# Altium schematic sheet filters.SchDoc
size 381 x 241 mm; SheetNumber: 5; SheetTotal: 11
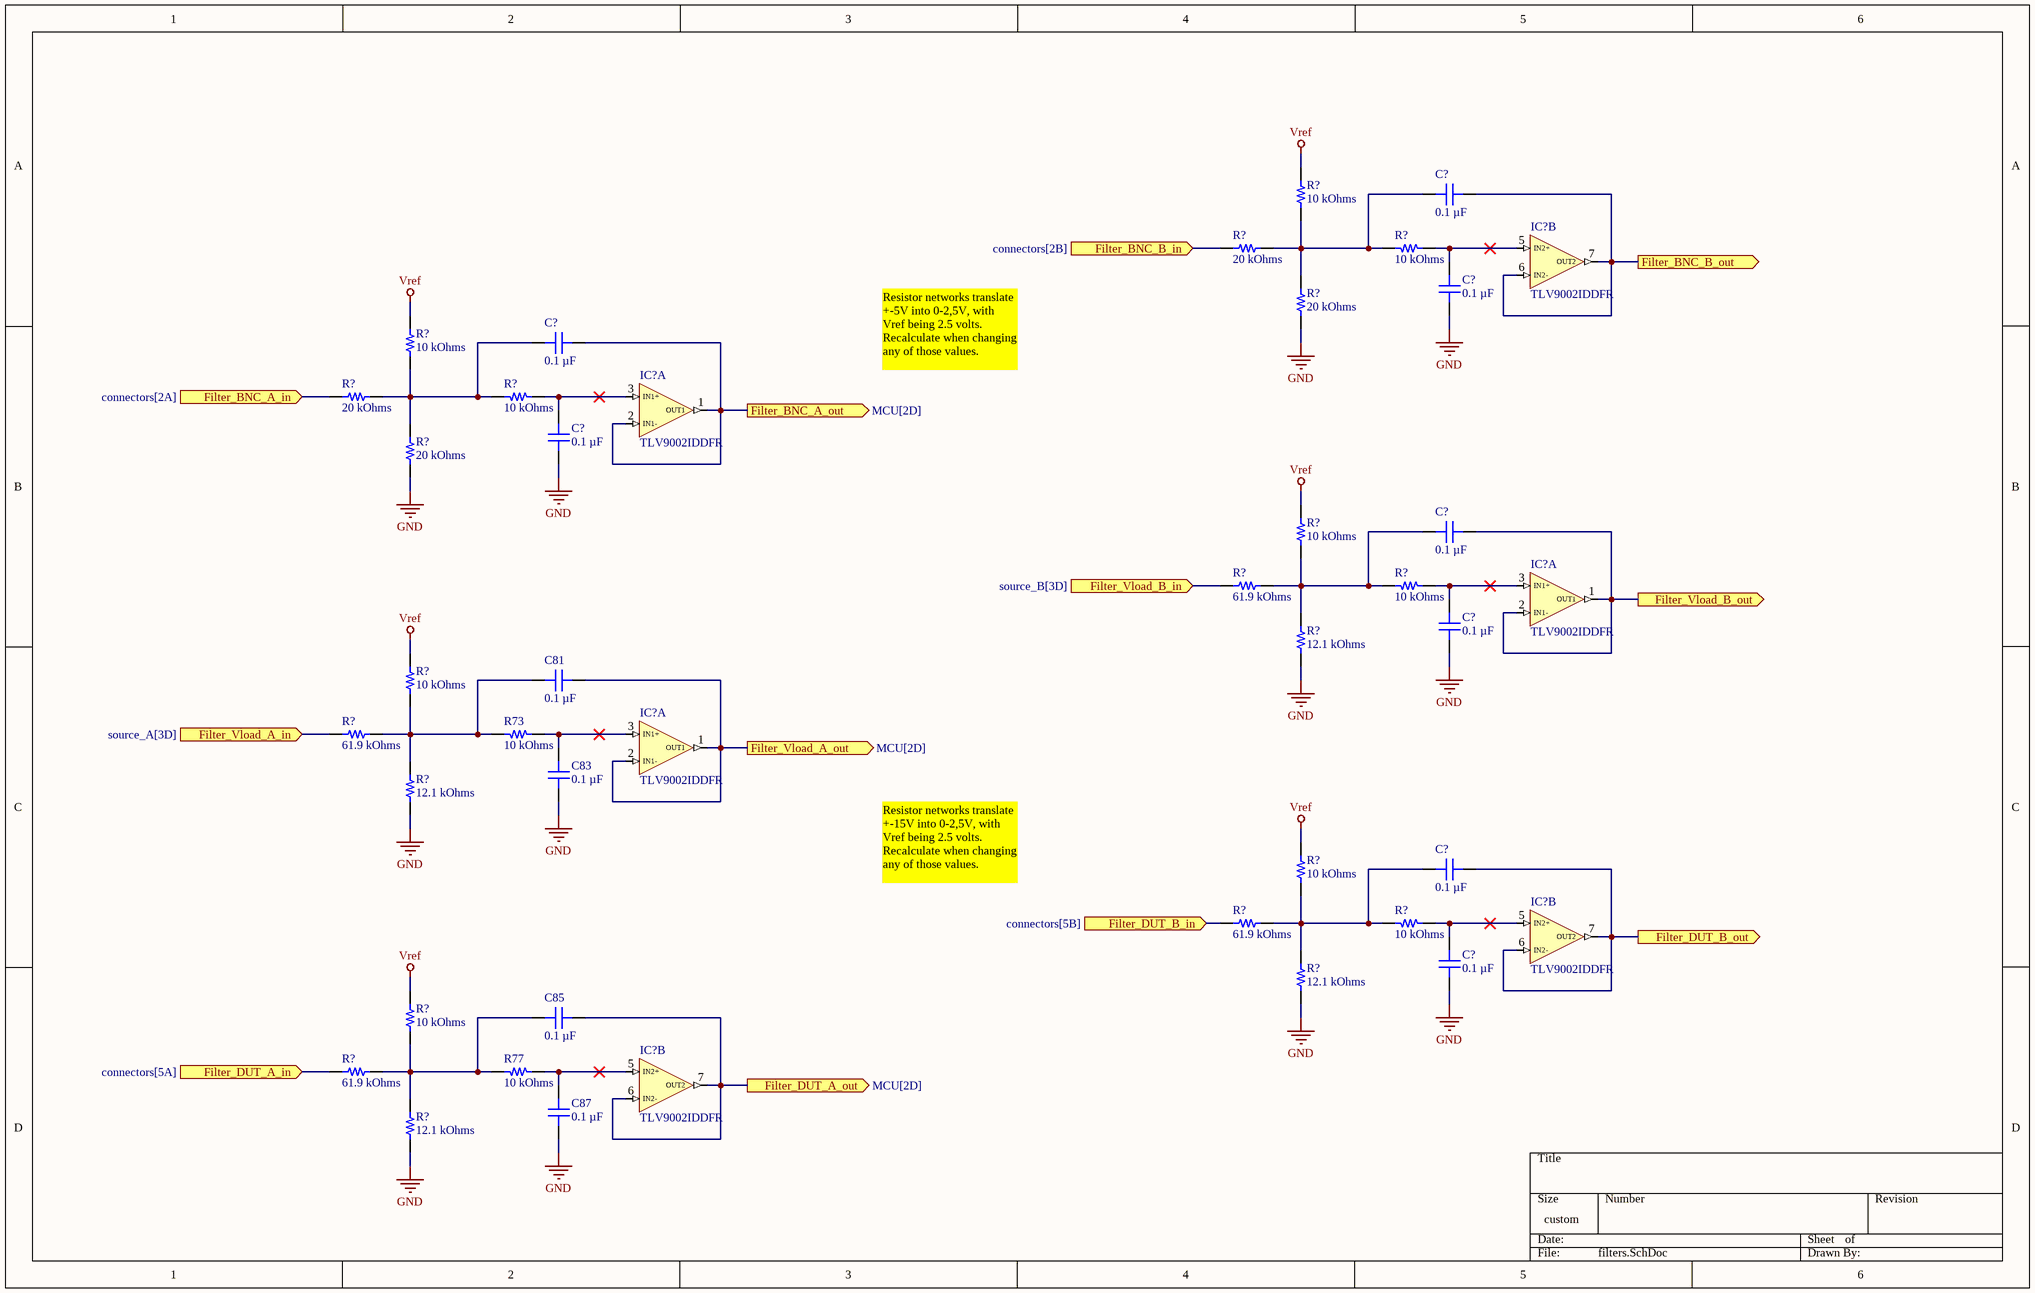
[diagram p0: filters.SchDoc]

## Parts
(Parts that share a designator on the sheet are numbered #1, #2 ... from top to bottom, then left to right.)
C81  0.1 µF  [CAP 1206_3216 - 0.8MM]
C83  0.1 µF  [CAP 1206_3216 - 0.8MM]
C85  0.1 µF  [CAP 1206_3216 - 0.8MM]
C87  0.1 µF  [CAP 1206_3216 - 0.8MM]
C?#1  0.1 µF  [CAP 1206_3216 - 0.8MM]
C?#2  0.1 µF  [CAP 1206_3216 - 0.8MM]
C?#3  0.1 µF  [CAP 1206_3216 - 0.8MM]
C?#4  0.1 µF  [CAP 1206_3216 - 0.8MM]
C?#5  0.1 µF  [CAP 1206_3216 - 0.8MM]
C?#6  0.1 µF  [CAP 1206_3216 - 0.8MM]
C?#7  0.1 µF  [CAP 1206_3216 - 0.8MM]
C?#8  0.1 µF  [CAP 1206_3216 - 0.8MM]
IC?#1  TLV9002IDDFR  [SOT65P280X110-8N]  (part B of 3)
IC?#2  TLV9002IDDFR  [SOT65P280X110-8N]  (part A of 3)
IC?#3  TLV9002IDDFR  [SOT65P280X110-8N]  (part A of 3)
IC?#4  TLV9002IDDFR  [SOT65P280X110-8N]  (part A of 3)
IC?#5  TLV9002IDDFR  [SOT65P280X110-8N]  (part B of 3)
IC?#6  TLV9002IDDFR  [SOT65P280X110-8N]  (part B of 3)
R73  10 kOhms  [YAGEO RES 1206_3216]
R77  10 kOhms  [YAGEO RES 1206_3216]
R?#1  10 kOhms  [RES 1206_3216]
R?#2  20 kOhms  [RES 1206_3216]
R?#3  10 kOhms  [YAGEO RES 1206_3216]
R?#4  20 kOhms  [RES 1206_3216]
R?#5  10 kOhms  [RES 1206_3216]
R?#6  20 kOhms  [RES 1206_3216]
R?#7  10 kOhms  [YAGEO RES 1206_3216]
R?#8  20 kOhms  [RES 1206_3216]
R?#9  10 kOhms  [RES 1206_3216]
R?#10  61.9 kOhms  [RES 1206_3216]
R?#11  10 kOhms  [YAGEO RES 1206_3216]
R?#12  12.1 kOhms  [RES 1206_3216]
R?#13  10 kOhms  [RES 1206_3216]
R?#14  61.9 kOhms  [RES 1206_3216]
R?#15  12.1 kOhms  [RES 1206_3216]
R?#16  10 kOhms  [RES 1206_3216]
R?#17  61.9 kOhms  [RES 1206_3216]
R?#18  10 kOhms  [YAGEO RES 1206_3216]
R?#19  12.1 kOhms  [RES 1206_3216]
R?#20  10 kOhms  [RES 1206_3216]
R?#21  61.9 kOhms  [RES 1206_3216]
R?#22  12.1 kOhms  [RES 1206_3216]

## Ports
Filter_BNC_A_in (in, see connectors[2A]), Filter_BNC_A_out (out, see MCU[2D]), Filter_BNC_B_in (in, see connectors[2B]), Filter_BNC_B_out (out), Filter_DUT_A_in (in, see connectors[5A]), Filter_DUT_A_out (out, see MCU[2D]), Filter_DUT_B_in (in, see connectors[5B]), Filter_DUT_B_out (out), Filter_Vload_A_in (in, see source_A[3D]), Filter_Vload_A_out (out, see MCU[2D]), Filter_Vload_B_in (in, see source_B[3D]), Filter_Vload_B_out (out)

## Nets
GND: C83.2 C87.2 C?#2.2 C?#4.2 C?#6.2 C?#8.2 R?#4.2 R?#8.2 R?#12.2 R?#15.2 R?#19.2 R?#22.2
Vref: R?#1.1 R?#5.1 R?#9.1 R?#13.1 R?#16.1 R?#20.1
Filter_BNC_A_in: R?#6.1 ; port Filter_BNC_A_in
Filter_BNC_A_out: C?#3.1 IC?#2.1(OUT1) IC?#2.2(IN1-) ; port Filter_BNC_A_out
Filter_BNC_B_in: R?#2.1 ; port Filter_BNC_B_in
Filter_BNC_B_out: C?#1.1 IC?#1.6(IN2-) IC?#1.7(OUT2) ; port Filter_BNC_B_out
Filter_DUT_A_in: R?#21.1 ; port Filter_DUT_A_in
Filter_DUT_A_out: C85.1 IC?#6.6(IN2-) IC?#6.7(OUT2) ; port Filter_DUT_A_out
Filter_DUT_B_in: R?#17.1 ; port Filter_DUT_B_in
Filter_DUT_B_out: C?#7.1 IC?#5.6(IN2-) IC?#5.7(OUT2) ; port Filter_DUT_B_out
Filter_Vload_A_in: R?#14.1 ; port Filter_Vload_A_in
Filter_Vload_A_out: C81.1 IC?#4.1(OUT1) IC?#4.2(IN1-) ; port Filter_Vload_A_out
Filter_Vload_B_in: R?#10.1 ; port Filter_Vload_B_in
Filter_Vload_B_out: C?#5.1 IC?#3.1(OUT1) IC?#3.2(IN1-) ; port Filter_Vload_B_out
NetC81_2: C81.2 R73.2 R?#13.2 R?#14.2 R?#15.1
NetC83_1: C83.1 IC?#4.3(IN1+) R73.1
NetC85_2: C85.2 R77.2 R?#20.2 R?#21.2 R?#22.1
NetC87_1: C87.1 IC?#6.5(IN2+) R77.1
NetC?#1_2: C?#1.2 R?#1.2 R?#2.2 R?#3.2 R?#4.1
NetC?#2_1: C?#2.1 IC?#1.5(IN2+) R?#3.1
NetC?#3_2: C?#3.2 R?#5.2 R?#6.2 R?#7.2 R?#8.1
NetC?#4_1: C?#4.1 IC?#2.3(IN1+) R?#7.1
NetC?#5_2: C?#5.2 R?#9.2 R?#10.2 R?#11.2 R?#12.1
NetC?#6_1: C?#6.1 IC?#3.3(IN1+) R?#11.1
NetC?#7_2: C?#7.2 R?#16.2 R?#17.2 R?#18.2 R?#19.1
NetC?#8_1: C?#8.1 IC?#5.5(IN2+) R?#18.1

## Notes on the sheet
- Resistor networks translate +-5V into 0-2,5V, with Vref being 2.5 volts. Recalculate when changing any of those values.
- Resistor networks translate +-15V into 0-2,5V, with Vref being 2.5 volts. Recalculate when changing any of those values.

## Library data of the parts
C81 C83 C85 C87 C?#1-C?#8 = 885012208087: CAP CER 0.1UF 50V X7R 1206; manufacturer: Würth Elektronik; Tolerance: ±10%; Part Number: 885012208087; Capacitance: 0.1 µF; Applications: General Purpose; componentlink1description: Datasheet; componentlink1url: https://katalog.we-online.de/pbs/datasheet/885012208087.pdf; componentlink2description: DigiKey Link; componentlink2url: https://www.digikey.com/en/products/detail/würth-elektronik/885012208087/5453982; Device Package: 1206 (3216 Metric); lastupdated: 6/4/2024 19:10:27; Lifecycle Status: Active; Minimum Order: 1; Mounting Type: Surface Mount, MLCC; Operating Temperature: -55°C ~ 125°C; Package / Case: 1206 (3216 Metric); packaging: TapeAndReel; partid: 20879; Part Status: Active; price: 0.06; series: WCAP-CSGP; Size / Dimension: 0.126" L x 0.063" W (3.20mm x 1.60mm); Supplier 1: DigiKey; Supplier Part Number 1: 732-8127-1-ND; Temperature Coefficient: X7R; Thickness (Max): 0.035" (0.90mm); value: 0.1 µF; Voltage - Rated: 50V
IC?#1-IC?#6 = TLV9002IDDFR: Integrated Circuit; Manufacturer_Name: Texas Instruments; Datasheet Link: https://www.ti.com/lit/gpn/TLV9002; Height: 1.1mm; Manufacturer_Part_Number: TLV9002IDDFR; Mouser Part Number: 595-TLV9002IDDFR; Mouser Price/Stock: https://www.mouser.co.uk/ProductDetail/Texas-Instruments/TLV9002IDDFR?qs=mAH9sUMRCtuVJ6NmNV%252Bgrw%3D%3D; Arrow Part Number: TLV9002IDDFR; Arrow Price/Stock: https://www.arrow.com/en/products/tlv9002iddfr/texas-instruments?utm_currency=USD&region=nac
R73 R77 R?#3 R?#7 R?#11 R?#18 = RT1206FRE0710KL: RES SMD 10K OHM 1% 1/4W 1206; Manufacturer: Yageo; Power (Watts): 0.25W, 1/4W; Temperature Coefficient: ±50ppm/°C; Part Number: RT1206FRE0710KL; ComponentLink1Description: Datasheet; ComponentLink1URL: https://www.yageo.com/upload/media/product/productsearch/datasheet/rchip/PYu-RT_1-to-0.01_RoHS_L_11.pdf; ComponentLink2Description: DigiKey Link; ComponentLink2URL: https://www.digikey.com/en/products/detail/yageo/RT1206FRE0710KL/1082868; Composition: Thin Film; Device Package: 1206 (3216 Metric); Height - Seated (Max): 0.026" (0.65mm); LastUpdated: 7/25/2024 09:21:28; Lifecycle Status: Active; Minimum Order: 1; Number of Terminations: 2; Operating Temperature: -55°C ~ 155°C; Package / Case: 1206 (3216 Metric); Packaging: TapeAndReel; PartId: 38903; Part Status: Active; Price: 0.01; Resistance: 10 kOhms; Series: RT; Size / Dimension: 0.122" L x 0.063" W (3.10mm x 1.60mm); Supplier 1: DigiKey; Supplier Part Number 1: YAG1242CT-ND; Supplier Device Package: 1206; Tolerance: ±1%; Value: 10 kOhms
R?#1 R?#5 R?#9 R?#13 R?#16 R?#20 = ERA-8AEB103V: RES SMD 10K OHM 0.1% 1/4W 1206; Manufacturer: Panasonic Electronic Components; Power (Watts): 0.25W, 1/4W; Temperature Coefficient: ±25ppm/°C; Part Number: ERA-8AEB103V; ComponentLink1Description: Datasheet; ComponentLink1URL: https://industrial.panasonic.com/cdbs/www-data/pdf/RDM0000/AOA0000C307.pdf; ComponentLink2Description: DigiKey Link; ComponentLink2URL: https://www.digikey.com/en/products/detail/panasonic-electronic-components/ERA-8AEB103V/3070742; Composition: Thin Film; Device Package: 1206 (3216 Metric); Features: Automotive AEC-Q200; Height - Seated (Max): 0.028" (0.70mm); LastUpdated: 2/9/2024 20:54:17; Lifecycle Status: Active; Minimum Order: 1; Number of Terminations: 2; Operating Temperature: -55°C ~ 155°C; Package / Case: 1206 (3216 Metric); Packaging: TapeAndReel; PartId: 33990; Part Status: Active; Price: 0.10; Ratings: AEC-Q200; Resistance: 10 kOhms; Series: ERA-8A; Size / Dimension: 0.126" L x 0.063" W (3.20mm x 1.60mm); Supplier 1: DigiKey; Supplier Part Number 1: P10KBCCT-ND; Supplier Device Package: 1206; Tolerance: ±0.1%; Value: 10 kOhms
R?#2 R?#4 R?#6 R?#8 = ERA-8AEB203V: RES SMD 20K OHM 0.1% 1/4W 1206; Manufacturer: Panasonic Electronic Components; Power (Watts): 0.25W, 1/4W; Temperature Coefficient: ±25ppm/°C; Part Number: ERA-8AEB203V; ComponentLink1Description: Datasheet; ComponentLink1URL: https://industrial.panasonic.com/cdbs/www-data/pdf/RDM0000/AOA0000C307.pdf; ComponentLink2Description: DigiKey Link; ComponentLink2URL: https://www.digikey.com/en/products/detail/panasonic-electronic-components/ERA-8AEB203V/3070867; Composition: Thin Film; Device Package: 1206 (3216 Metric); Features: Automotive AEC-Q200; Height - Seated (Max): 0.028" (0.70mm); LastUpdated: 2/9/2024 20:54:17; Lifecycle Status: Active; Minimum Order: 1; Number of Terminations: 2; Operating Temperature: -55°C ~ 155°C; Package / Case: 1206 (3216 Metric); Packaging: TapeAndReel; PartId: 33988; Part Status: Active; Price: 0.10; Ratings: AEC-Q200; Resistance: 20 kOhms; Series: ERA-8A; Size / Dimension: 0.126" L x 0.063" W (3.20mm x 1.60mm); Supplier 1: DigiKey; Supplier Part Number 1: P20KBCCT-ND; Supplier Device Package: 1206; Tolerance: ±0.1%; Value: 20 kOhms
R?#10 R?#14 R?#17 R?#21 = ERA-8AEB6192V: RES SMD 61.9K OHM 0.1% 1/4W 1206; Manufacturer: Panasonic Electronic Components; Power (Watts): 0.25W, 1/4W; Temperature Coefficient: ±25ppm/°C; Part Number: ERA-8AEB6192V; ComponentLink1Description: Datasheet; ComponentLink1URL: https://industrial.panasonic.com/cdbs/www-data/pdf/RDM0000/AOA0000C307.pdf; ComponentLink2Description: DigiKey Link; ComponentLink2URL: https://www.digikey.com/en/products/detail/panasonic-electronic-components/ERA-8AEB6192V/3071114; Composition: Thin Film; Device Package: 1206 (3216 Metric); Features: Automotive AEC-Q200; Height - Seated (Max): 0.028" (0.70mm); LastUpdated: 2/9/2024 20:53:52; Lifecycle Status: Active; Minimum Order: 1; Number of Terminations: 2; Operating Temperature: -55°C ~ 155°C; Package / Case: 1206 (3216 Metric); Packaging: TapeAndReel; PartId: 41065; Part Status: Active; Price: 0.10; Ratings: AEC-Q200; Resistance: 61.9 kOhms; Series: ERA-8A; Size / Dimension: 0.126" L x 0.063" W (3.20mm x 1.60mm); Supplier 1: DigiKey; Supplier Part Number 1: P61.9KBCCT-ND; Supplier Device Package: 1206; Tolerance: ±0.1%; Value: 61.9 kOhms
R?#12 R?#15 R?#19 R?#22 = ERA-8AEB1212V: RES SMD 12.1K OHM 0.1% 1/4W 1206; Manufacturer: Panasonic Electronic Components; Power (Watts): 0.25W, 1/4W; Temperature Coefficient: ±25ppm/°C; Part Number: ERA-8AEB1212V; ComponentLink1Description: Datasheet; ComponentLink1URL: https://industrial.panasonic.com/cdbs/www-data/pdf/RDM0000/AOA0000C307.pdf; ComponentLink2Description: DigiKey Link; ComponentLink2URL: https://www.digikey.com/en/products/detail/panasonic-electronic-components/ERA-8AEB1212V/3070771; Composition: Thin Film; Device Package: 1206 (3216 Metric); Features: Automotive AEC-Q200; Height - Seated (Max): 0.028" (0.70mm); LastUpdated: 2/9/2024 20:54:30; Lifecycle Status: Active; Minimum Order: 1; Number of Terminations: 2; Operating Temperature: -55°C ~ 155°C; Package / Case: 1206 (3216 Metric); Packaging: TapeAndReel; PartId: 30396; Part Status: Active; Price: 0.10; Ratings: AEC-Q200; Resistance: 12.1 kOhms; Series: ERA-8A; Size / Dimension: 0.126" L x 0.063" W (3.20mm x 1.60mm); Supplier 1: DigiKey; Supplier Part Number 1: 10-ERA-8AEB1212VCT-ND; Supplier Device Package: 1206; Tolerance: ±0.1%; Value: 12.1 kOhms